# EAGLE schematic ELEC327_V4 (EAGLE 9.6.2)
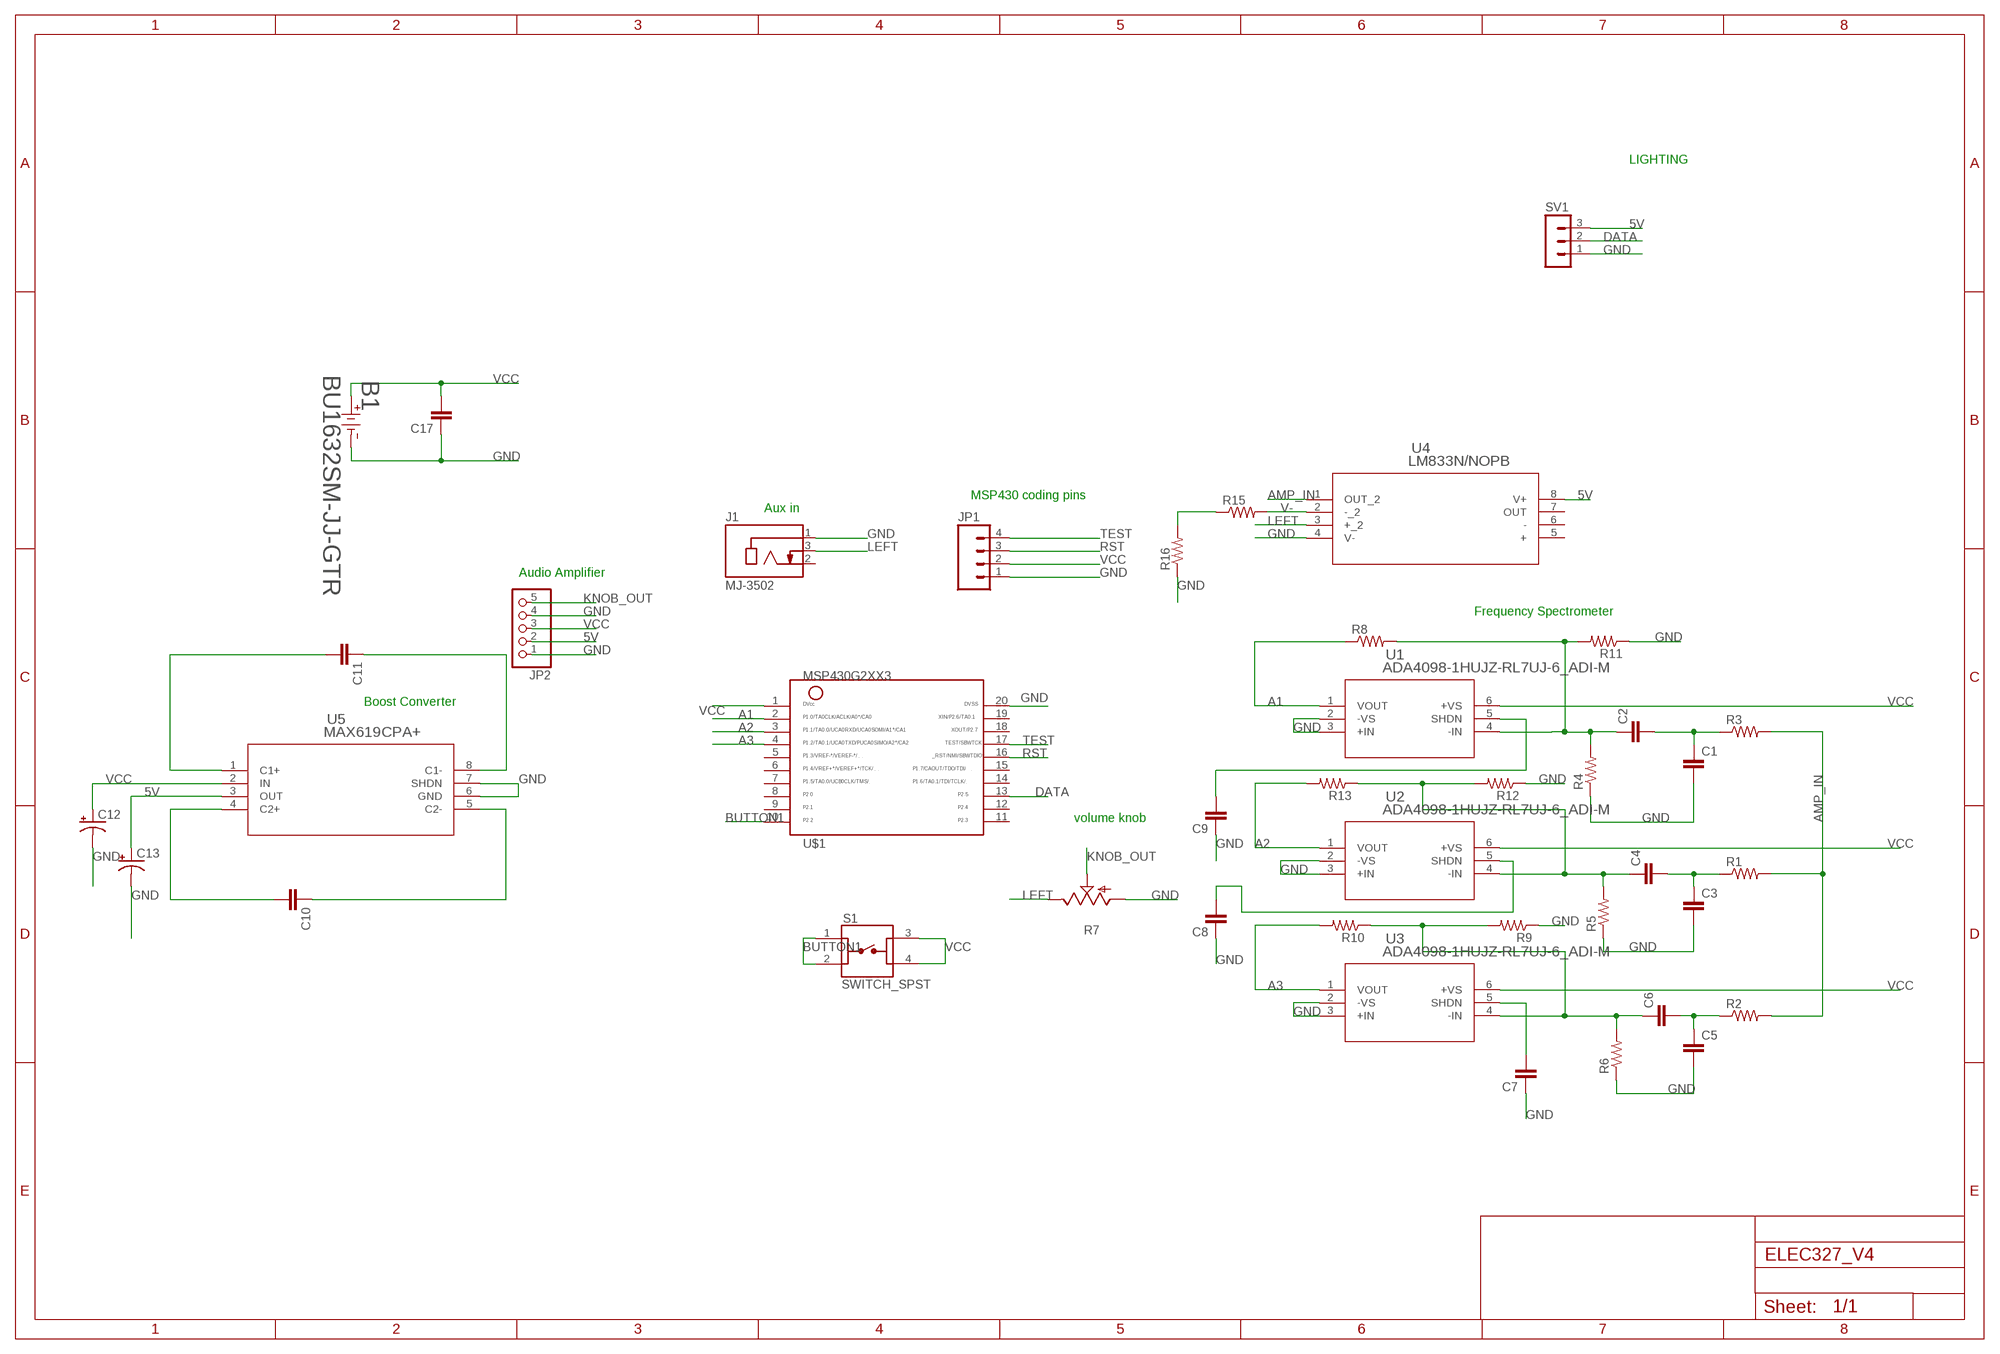
[diagram p0: schematic, sheet 1]

## Parts
B1  BU1632SM-JJ-GTR  [BU1632SM-JJ-GTR_MPD]
C1  C-EUC1206  [C1206]
C2  C-EUC1206  [C1206]
C3  C-EUC1206  [C1206]
C4  C-EUC1206  [C1206]
C5  C-EUC1206  [C1206]
C6  C-EUC1206  [C1206]
C7  C-EUC1206  [C1206]
C8  C-EUC1206  [C1206]
C9  C-EUC1206  [C1206]
C10  C-EUC1206  [C1206]
C11  C-EUC1206  [C1206]
C12  CPOL-USE5-6  [E5-6]
C13  CPOL-USE5-6  [E5-6]
C17  C-EUC1206  [C1206]
J1  MJ-3502  [CUI_MJ-3502]
JP1  HEADER_1X04LOCK  [1X04_LOCK]
JP2  PINHD-1X55X2MM  [1_05X2MM]
R1  R-US_R1206  [R1206]
R2  R-US_R1206  [R1206]
R3  R-US_R1206  [R1206]
R4  R-US_R1206  [R1206]
R5  R-US_R1206  [R1206]
R6  R-US_R1206  [R1206]
R7  TRIM_US-B25X  [B25X]
R8  R-US_R1206  [R1206]
R9  R-US_R1206  [R1206]
R10  R-US_R1206  [R1206]
R11  R-US_R1206  [R1206]
R12  R-US_R1206  [R1206]
R13  R-US_R1206  [R1206]
R15  R-US_R1206  [R1206]
R16  R-US_R1206  [R1206]
S1  SWITCH_SPST  [SW_1825910-7]
SV1  MA03-1  [MA03-1]
U1  ADA4098-1HUJZ-RL7UJ-6_ADI-M  [UJ-6_ADI-M]
U2  ADA4098-1HUJZ-RL7UJ-6_ADI-M  [UJ-6_ADI-M]
U3  ADA4098-1HUJZ-RL7UJ-6_ADI-M  [UJ-6_ADI-M]
U4  LM833N/NOPB  [N08E_TEX]
U5  MAX619CPA+  [21-0043D_8_MXM]
U$1  MSP430G2XX3TSSOP  [PW20]

## Nets
5V: C13.+ JP2.2 SV1.3 U4.8(V+) U5.3(OUT)
A1: R8.1 U1.1(VOUT) U$1.2
A2: R13.2 U2.1(VOUT) U$1.3
A3: R10.2 U3.1(VOUT) U$1.4
AMP_IN: R1.2 R2.2 R3.2 U4.1(OUT_2)
BUTTON1: S1.1 S1.2 U$1.10
DATA: SV1.2 U$1.13
GND: B1.2 C1.2 C3.2 C5.2 C7.1 C8.1 C9.1 C12.- C13.- C17.1 J1.1 JP1.1 JP2.1 JP2.4 R4.1 R5.1 R6.1 R7.A R9.1 R11.1 R12.1 R16.1 SV1.1 U1.2(-VS) U1.3(+IN) U2.2(-VS) U2.3(+IN) U3.2(-VS) U3.3(+IN) U4.4(V-) U5.6(GND) U5.7(SHDN) U$1.20
KNOB_OUT: JP2.5 R7.S
LEFT: J1.3 R7.E U4.3(+_2)
N$1: C2.1 R4.2 R8.2 R11.2 U1.4(-IN)
N$2: C1.1 C2.2 R3.1
N$3: C3.1 C4.2 R1.1
N$4: C5.1 C6.2 R2.1
N$5: C4.1 R5.2 R12.2 R13.1 U2.4(-IN)
N$6: C7.2 U3.5(SHDN)
N$7: C6.1 R6.2 R9.2 R10.1 U3.4(-IN)
N$8: C8.2 U2.5(SHDN)
N$9: C9.2 U1.5(SHDN)
N$10: C10.2 U5.4(C2+)
N$11: C10.1 U5.5(C2-)
N$12: C11.2 U5.1(C1+)
N$13: C11.1 U5.8(C1-)
N$14: R15.1 R16.2
RST: JP1.3 U$1.16
TEST: JP1.4 U$1.17
V-: R15.2 U4.2(-_2)
VCC: B1.1 C12.+ C17.2 JP1.2 JP2.3 S1.3 S1.4 U1.6(+VS) U2.6(+VS) U3.6(+VS) U5.2(IN) U$1.1
Unconnected: J1.2 U4.5(+) U4.6(-) U4.7(OUT) U$1.5 U$1.6 U$1.7 U$1.8 U$1.9 U$1.11 U$1.12 U$1.14 U$1.15 U$1.18 U$1.19

## Notes on the sheet
- LIGHTING
- MSP430 coding pins
- Aux in
- Audio Amplifier
- Frequency Spectrometer
- Boost Converter
- volume knob

## Library data of the parts
B1 = ELEC327:BU1632SM-JJ-GTR; COPYRIGHT: Copyright (C) 2023 Ultra Librarian. All rights reserved.; MANUFACTURER_PART_NUMBER: BU1632SM-JJ-GTR; MFR_NAME: Memory Protection Devices
C1-C11 C17 = rcl:C-EU: CAPACITOR, European symbol; SPICEPREFIX: C
C12 C13 = rcl:CPOL-US: POLARIZED CAPACITOR, American symbol; SPICEPREFIX: C
J1 = MJ-3502:MJ-3502: 3.5 mm, Mono, Right Angle, Through Hole, Threaded Bushing, Audio Jack Connector; MANUFACTURER: CUI INC; PART_REV: A; STANDARD: MANUFACTURER RECOMMENDATIONS
JP1 = ELEC327:HEADER_1X04: Header 4 Standard 4-pin 0.1" header. Use with straight break away headers (SKU : PRT-00116), right angle break away headers (PRT-00553), swiss pins (PRT-00743), machine pins (PRT-00117), and female headers (PRT-00115). Molex polarized connector foot print use with SKU : PRT-08231 with associated crimp pins and housings.
JP2 = pinhead:PINHD-1X5: PIN HEADER
R1-R6 R8-R13 R15 R16 = rcl:R-US_: RESISTOR, American symbol; SPICEPREFIX: R
R7 = pot:TRIM_US-: POTENTIOMETER
S1 = ELEC327:SWITCH_SPST: TE Connectivity Alcoswitch, 6mm Switch Tactile OFF (ON) SPST Round Button PC Pins 0.05A 24VDC 100000Cycles 2.55N Thru-Hole Loose Through Hole Version 1825910-7 <https://www.digikey.com/en/products/detail/te-connectivity-alcoswitch-switches/1825910-7/1731414> Surface Mount Version 1571563-4 <https://www.digikey.com/en/products/detail/te-connectivity-alcoswitch-switches/1571563-4/2400231>; COMMENT: 1825910-7; CONFIGURATION_POLE-THROW: Single Pole - Single Throw; CONTACT_CURRENT_RATING: 50 mA; DESCRIPTION: Switch Tactile OFF (ON) SPST Round Button PC Pins 0.05A 24VDC 100000Cycle 2.55N Thru-Hole Loose Piece; DIGI-KEY_PART_NUMBER: 450-1804-ND; EU_ROHS_COMPLIANCE: Compliant; MF: TE Connectivity; MP: 1825910-7; PACKAGE: None; PURCHASE-URL: https://pricing.snapeda.com/search/part/1825910-7/?ref=eda
SV1 = con-lstb:MA03-1: PIN HEADER; OC_FARNELL: unknown; OC_NEWARK: unknown
U1-U3 = ADA4098:ADA4098-1HUJZ-RL7; COPYRIGHT: Copyright (C) 2023 Ultra Librarian. All rights reserved.; MANUFACTURER_PART_NUMBER: ADA4098-1HUJZ-RL7; MFR_NAME: Analog Devices Inc
U4 = LM833N:LM833N/NOPB; COPYRIGHT: Copyright (C) 2023 Ultra Librarian. All rights reserved.; MANUFACTURER_PART_NUMBER: LM833N/NOPB; MFR_NAME: Texas Instruments
U5 = ul_MAX619CPA-:MAX619CPA+; COPYRIGHT: Copyright (C) 2023 Ultra Librarian. All rights reserved.; MANUFACTURER_PART_NUMBER: MAX619CPA+; MFR_NAME: Analog Devices Inc
U$1 = ELEC327:MSP430G2XX3: MSP430G2XX3 PDIP (N) 20 Pin Package